# EAGLE design harp behavior encoder v1.2 (EAGLE 9.6.2)
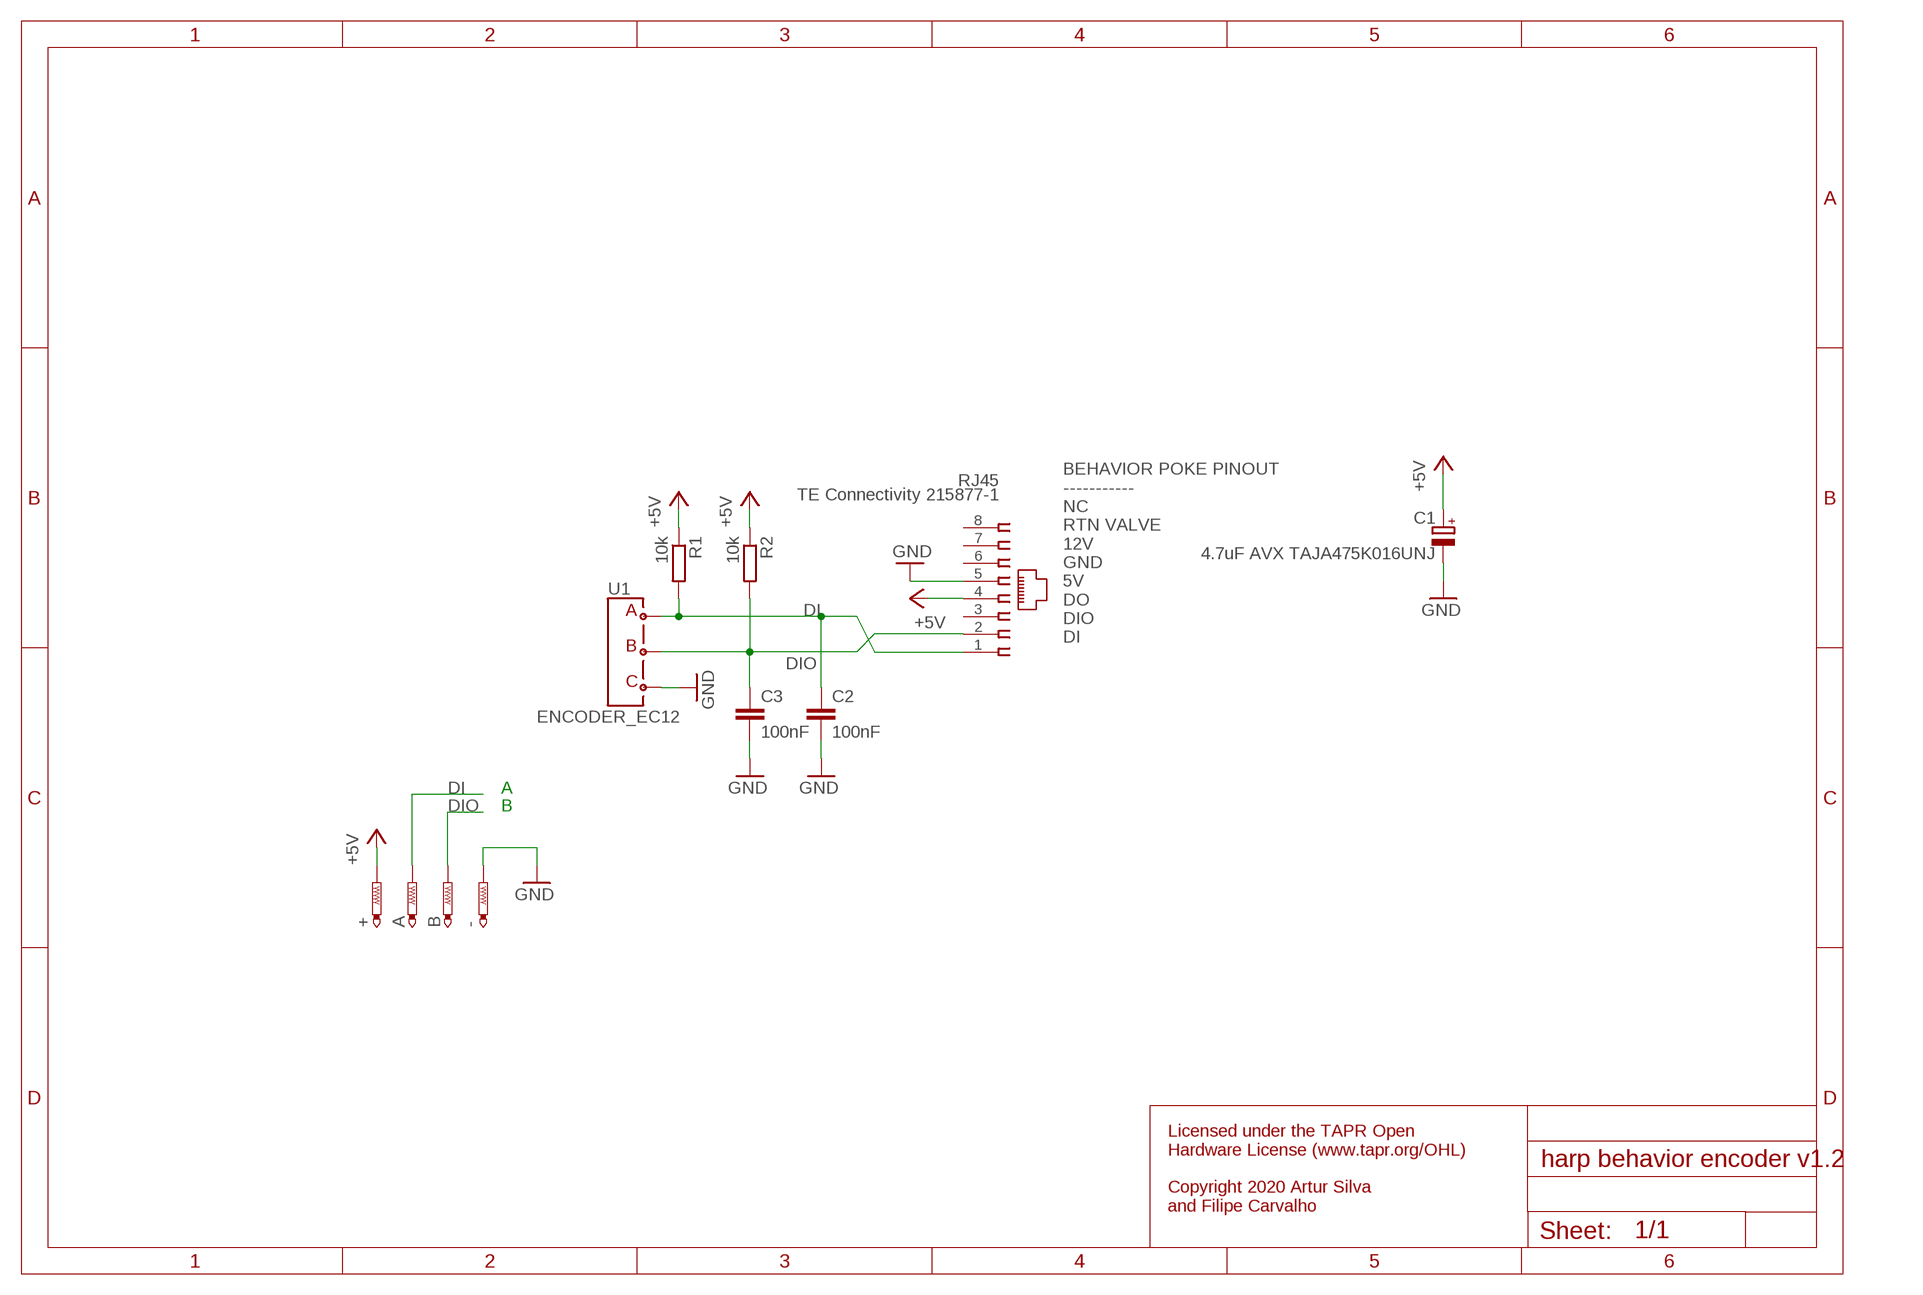
[diagram p0: schematic, sheet 1]

## Parts
+  PTR1PAD1-13  [P1-13]
-  PTR1PAD1-13  [P1-13]
A  PTR1PAD1-13  [P1-13]
B  PTR1PAD1-13  [P1-13]
C1  4.7uF AVX TAJA475K016UNJ  CPOL-EUA/3216-18W  [A/3216-18W]
C2  100nF  C-EUC0402  [C0402]
C3  100nF  C-EUC0402  [C0402]
R1  10k  R-EU_R0402  [R0402]
R2  10k  R-EU_R0402  [R0402]
RJ45  TE Connectivity 215877-1  520426-4  [520426-4]
U1  ENCODER_EC12  [ENCODER_EC12]

## Nets
+5V: +.TP C1.+ R1.1 R2.1 RJ45.4
DI: A.TP C2.1 R1.2 RJ45.1 U1.A
DIO: B.TP C3.1 R2.2 RJ45.2 U1.B
GND: -.TP C1.- C2.2 C3.2 RJ45.5 U1.C
Unconnected: RJ45.3 RJ45.6 RJ45.7 RJ45.8

## Notes on the sheet
- BEHAVIOR POKE PINOUT
  -----------
  NC
  RTN VALVE
  12V
  GND
  5V
  DO
  DIO
  DI
- A
- B
- Licensed under the TAPR Open 
  Hardware License (www.tapr.org/OHL)
  
  Copyright 2020 Artur Silva 
  and Filipe Carvalho

## Library data of the parts
+ - A B = testpad:PTR1: TEST PIN
C1 = rcl:CPOL-EU: POLARIZED CAPACITOR, European symbol
C2 C3 = rcl:C-EU: CAPACITOR, European symbol
R1 R2 = rcl:R-EU_: RESISTOR, European symbol
RJ45 = con-amp:520426-4: AMP connector
U1 = CNP-miscellaneous:ENCODER_EC12

## Board
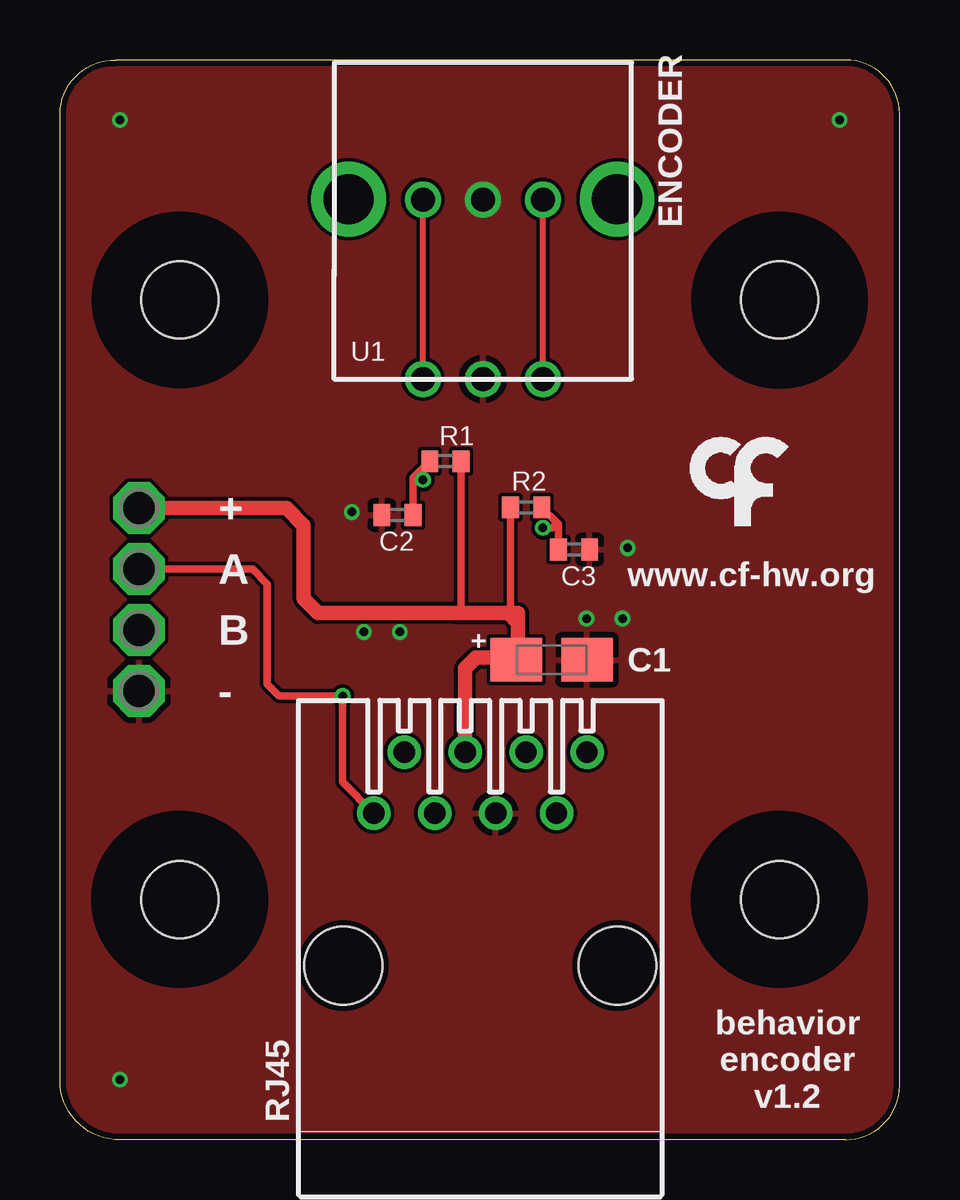
[diagram p1: board, top side]
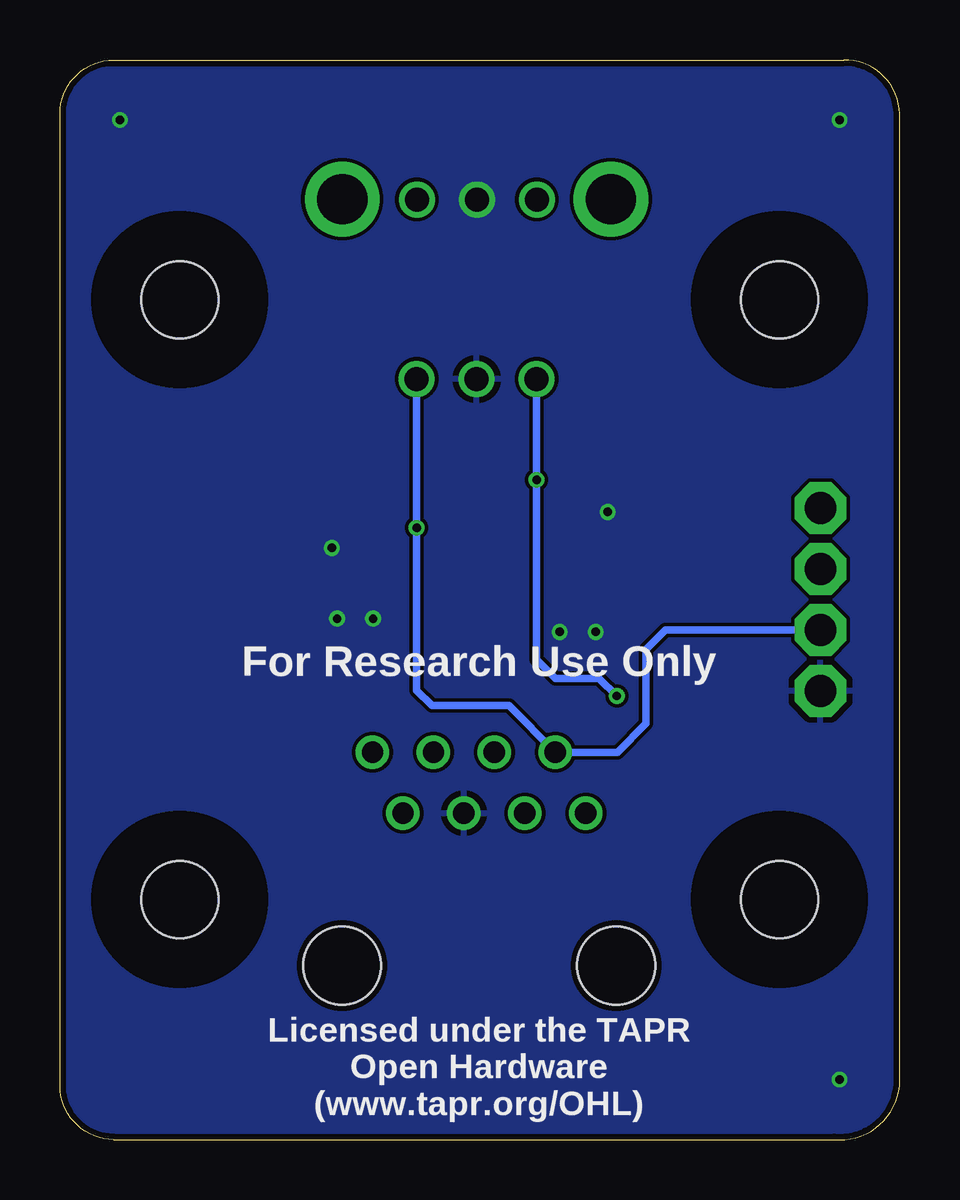
[diagram p2: board, bottom side, seen from below]

Size 35 x 45.01 mm. Coordinates in mm from the lower left corner, seen from the top.
Outline: 32.76,0.01 2.74,0.01 arc-90 0,2.25 0,42.78 arc-90 2.33,45.01 32.76,45.01 arc-90 35,42.78 35,2.25 arc-90 32.76,0.01
Copper layers (1*16): Top 0.035mm / dielectric 1.5mm / Bottom 0.035mm
Design rules "SeeedStudio_2layer_DRU_no_angle_20140221": minimum track width 6mil, minimum drill 12mil, track to track 6mil, track to pad 6mil, pad to pad 6mil, via to via 6mil, smd to smd 0mil, copper to edge 10mil, drill to drill 10mil, minimum pad ring 10mil, minimum via ring 6mil, stop-mask expansion 2mil, vias tented up to drill 100mil, thermal gap 10mil
Holes 3.2 mm at 5,10.01 30,10.01 5,35.01 30,35.01
tRestrict: area 1.3,31.3 to 8.7,38.7; area 26.3,31.3 to 33.7,38.7; area 1.3,6.3 to 8.7,13.7; area 26.3,6.3 to 33.7,13.7
bRestrict: area 1.3,31.3 to 8.7,38.7; area 26.3,31.3 to 33.7,38.7; area 1.3,6.3 to 8.7,13.7; area 26.3,6.3 to 33.7,13.7

### Footprints (pad centres in the part's own frame; a part is rotated, then mirrored left to right if it is on the bottom)
P1-13 = drill 1.321 pad 2.159 octagon: TP 0,0
A/3216-18W = smd 2.15 x 1.8: + 1.475,0; - -1.475,0
C0402 = smd 0.7 x 0.9: 1 -0.65,0; 2 0.65,0
R0402 = smd 0.7 x 0.9: 1 -0.65,0; 2 0.65,0
520426-4 = drill 0.889: 1 -4.445,6.35; 2 -3.175,8.89; 3 -1.905,6.35; 4 -0.635,8.89; 5 0.635,6.35; 6 1.905,8.89; 7 3.175,6.35; 8 4.445,8.89 | hole 3.251: -5.715,0; 5.715,0
ENCODER_EC12 = drill 1: A -2.5,0; B 2.5,0; C 0,0 | drill 2.1: A1 -5.6,7.5; A2 5.6,7.5

### Placement (x,y rotation side)
+  3.29,26.33 0 top
-  3.29,18.71 0 top
A  3.29,23.79 0 top
B  3.29,21.25 0 top
C1  20.5,20.01 180 top
C2  14.07,26.04 180 top
C3  21.43,24.61 0 top
R1  16.07,28.29 180 top
R2  19.43,26.36 0 top
RJ45  17.52,7.27 0 top
U1  17.63,31.71 0 top
U$3  [LOGO_7]  27.5,28.01 0 top

### Tracks (layer width: path | path; a pad name or v marks a point on that pad's centre or on a via)
+5V
  Top 0.305: R1.1 16.72,22.18 16.5,21.96 | R2.1 18.78,22.04 18.69,21.96
  Top 0.61: RJ45.4 16.89,19.65 17.35,20.11 19.08,20.11 19.1,20.09 | 18.69,21.96 16.5,21.96 10.77,21.96 10.16,22.57 10.16,25.62 9.45,26.33 +.TP | 18.69,21.96 19.1,21.96 19.1,21.55 | 19.1,21.55 19.1,20.09 | 19.1,20.09 C1.+ | 18.69,21.96 19.1,21.55
DI  (via drill 0.35, 1)
  Top 0.254: U1.A 15.13,39.19 v15.12,39.2
  Top 0.305: A.TP 8.03,23.79 8.64,23.18 8.64,19.01 9.14,18.5 v11.79,18.5 11.79,14.91 RJ45.1 | C2.1 14.72,27.59 | R1.2 14.72,27.59 | 14.72,27.59 14.8,27.51 v15.13,27.51
  Bottom 0.305: v11.79,18.5 12.52,19.24 14.35,19.24 15.13,20.02 v15.13,27.51 U1.A
DIO  (via drill 0.35, 1)
  Top 0.254: U1.B 20.13,39.19 v20.12,39.2
  Top 0.305: R2.2 20.71,25.73 | 20.71,25.73 20.78,25.66 C3.1 | 20.71,25.73 20.5,25.51 v20.13,25.51
  Bottom 0.305: U1.B v20.13,25.51 20.13,18.73 19.5,18.1 16.29,18.1 RJ45.2 11.76,16.16 10.57,17.35 10.57,20.44 9.76,21.25 B.TP
GND  (via drill 0.35, 1)
  other vias: 2.5,2.51 2.5,42.51 32.5,42.51 14.16,21.17 23.45,21.73 12.66,21.17 21.95,21.73 12.16,26.17 23.66,24.67 17.62,39.2
  pour Bottom: 0,45.01 35,45.01 35,0.01 0,0.06
  pour Top: 0,45.01 35,45.01 35,0.01 0,0.01

### Text on the board
tPlace: ENCODER | www.cf-hw.org | + | behavior / encoder / v1.2 | Licensed under the TAPR Open / Hardware License (www.tapr.org/OHL) / / Copyright 2021 Hardware Platform
bPlace: For Research Use Only | Licensed under the TAPR / Open Hardware / (www.tapr.org/OHL)